# EAGLE design sx-rj45-verteiler-m-einspeisung (EAGLE 7.4.0)
Selectrix Arduino
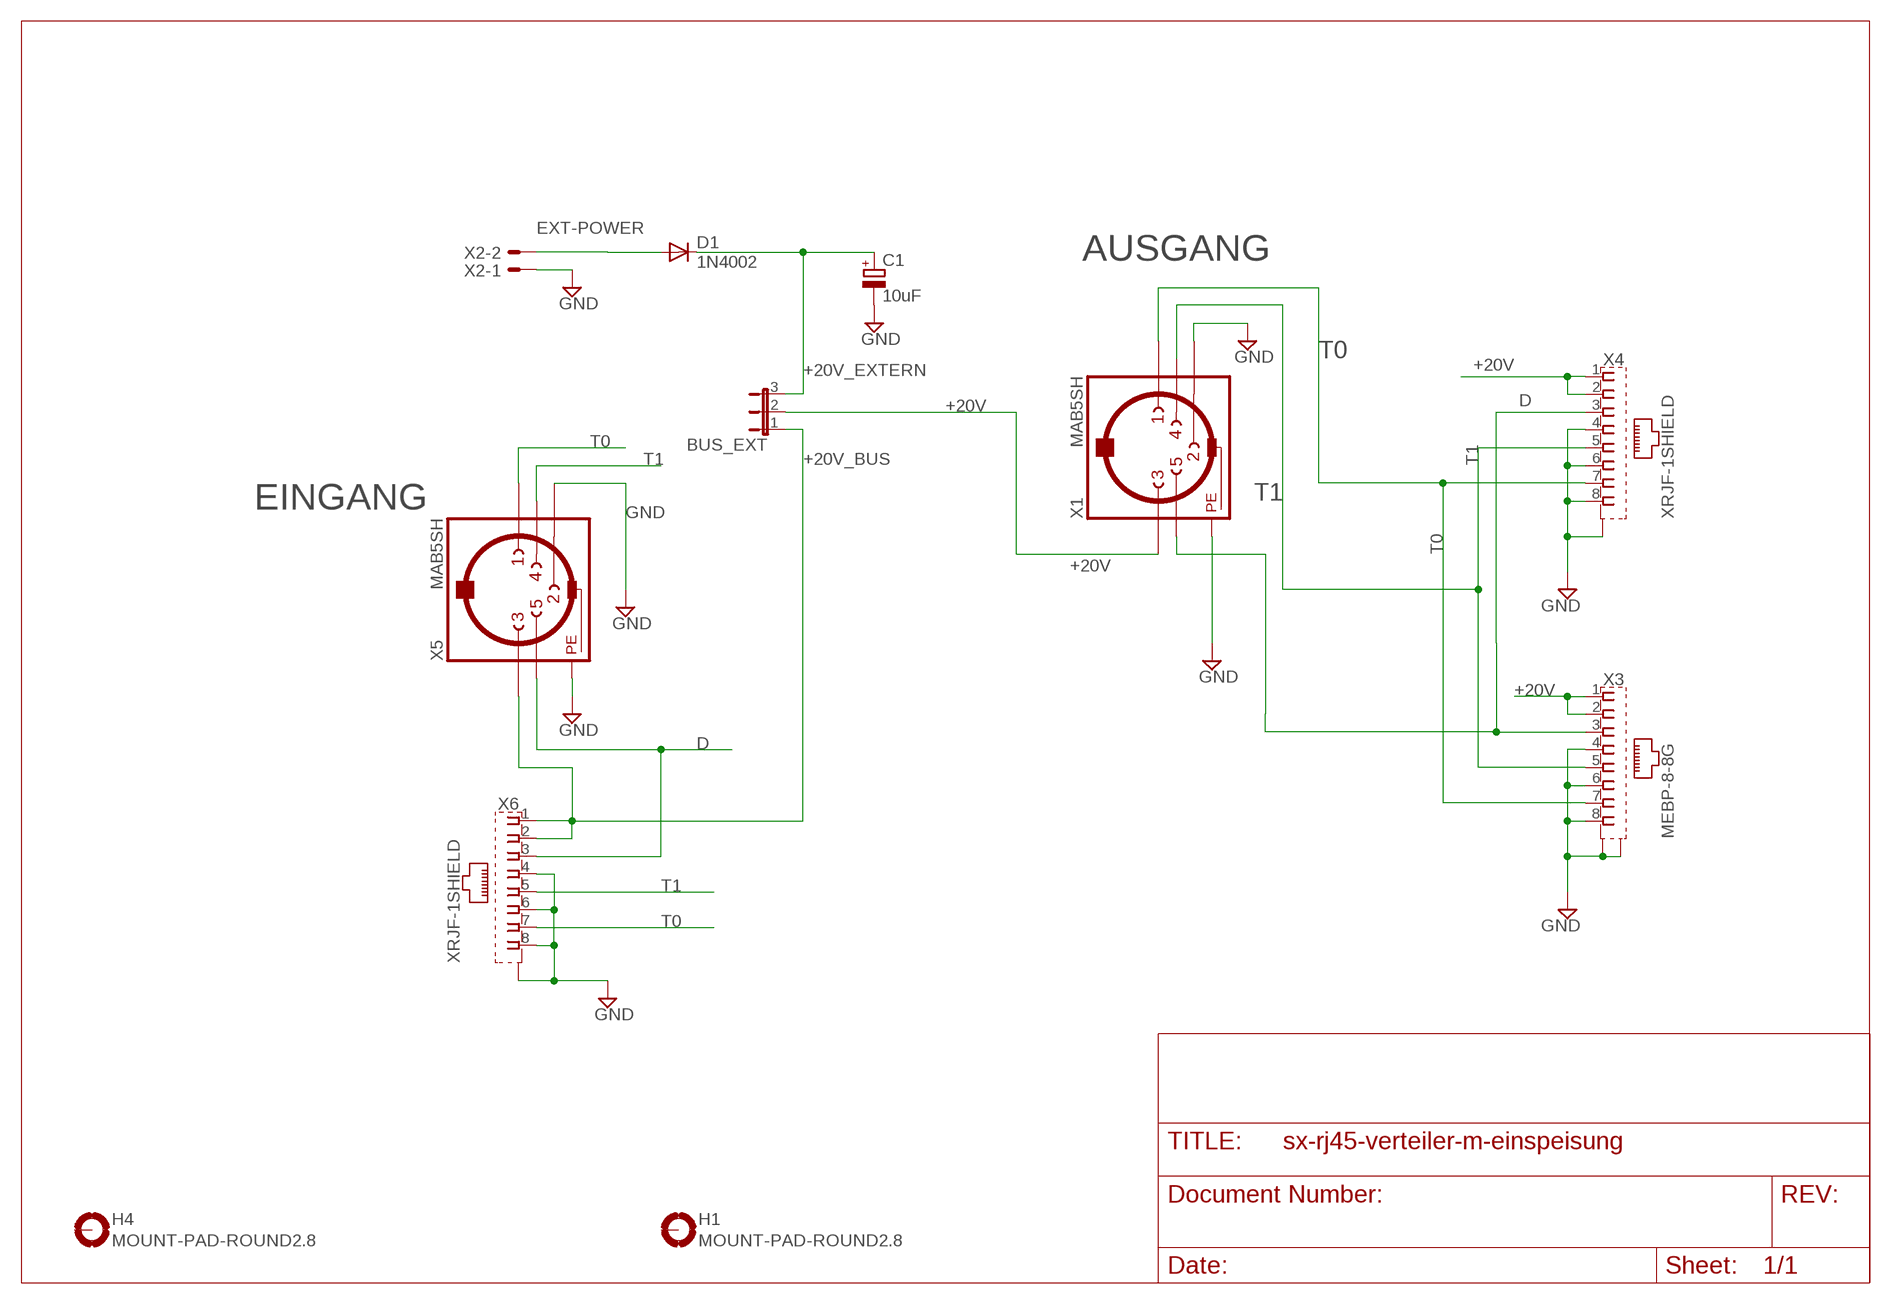
[diagram p0: schematic, sheet 1]

## Parts
BUS_EXT  JP2E  [JP2]
C1  10uF  CPOL-EUE2.5-7  [E2,5-7]
D1  1N4002  DIODE-DO201-15  [DO201-15]
H1  MOUNT-PAD-ROUND2.8  [2,8-PAD]
H4  MOUNT-PAD-ROUND2.8  [2,8-PAD]
X1  MAB5SH  [MAB5SH]
X2  AKL18X-02W  [AKL182-02]
X3  MEBP-8-8G  XRJF-01A-0-D2A-010MEBP-8-8G  [XRJF-01A-0-D2A-010]
X4  XRJF-1SHIELD  [XRJF-01A-OHNE_LOCH]
X5  MAB5SH  [MAB5SH]
X6  XRJF-1SHIELD  [XRJF-01A-OHNE_LOCH]

## Nets
+20V: BUS_EXT.2 X1.3 X3.1 X3.2 X4.1 X4.2
+20V_BUS [power]: BUS_EXT.1 X5.3 X6.1 X6.2
+20V_EXTERN: BUS_EXT.3 C1.+ D1.C
D: X1.5 X3.3 X4.3 X5.5 X6.3
EXT-POWER: D1.A X2.P$2
GND: C1.- X1.2 X1.PE X1.PE1(PE) X1.PE@1(PE) X1.PE@(PE) X2.P$1 X3.4 X3.6 X3.8 X3.S1(S) X3.S2(S) X4.4 X4.6 X4.8 X4.S1(S) X5.2 X5.PE X5.PE1(PE) X5.PE@1(PE) X5.PE@(PE) X6.4 X6.6 X6.8 X6.S1(S)
T0: X1.1 X3.7 X4.7 X5.1 X6.7
T1: X1.4 X3.5 X4.5 X5.4 X6.5
Unconnected: H1.B2,8(MOUNT) H4.B2,8(MOUNT)

## Notes on the sheet
- AUSGANG
- EINGANG

## Library data of the parts
BUS_EXT = jumper:JP2E: JUMPER
C1 = resistor:CPOL-EU: POLARIZED CAPACITOR, European symbol
D1 = diode:DIODE-: DIODE
H1 H4 = holes:MOUNT-PAD-ROUND: MOUNTING PAD, round
X1 X5 = con-hirschmann:MAB5SH: Female CONNECTOR 5 pins 90 deg. with shield, horizontal (DIN 41524); OC_FARNELL: 809883; OC_NEWARK: unknown
X2 = con-riacon_akl:AKL18X-02: Riacon AKL18X Steckverbinder 2-Pol Grid = 3,5mm
X3 = con-xmultiple-MB:XRJF: RJ45 Modular Buchse, without LED, schielded Source: Reichelt MEBP 8-8G http://cdn-reichelt.de/documents/datenblatt/G100/MEBP8-8G%23IMP.pdf
X4 X6 = con-xmultiple-MB2:XRJF-1SHIELD: RJ45 Modular Buchse, without LED, schielded Source: Reichelt MEBP 8-8G http://cdn-reichelt.de/documents/datenblatt/G100/MEBP8-8G%23IMP.pdf

## Net classes
1 power: width 0.61 mm

## Board
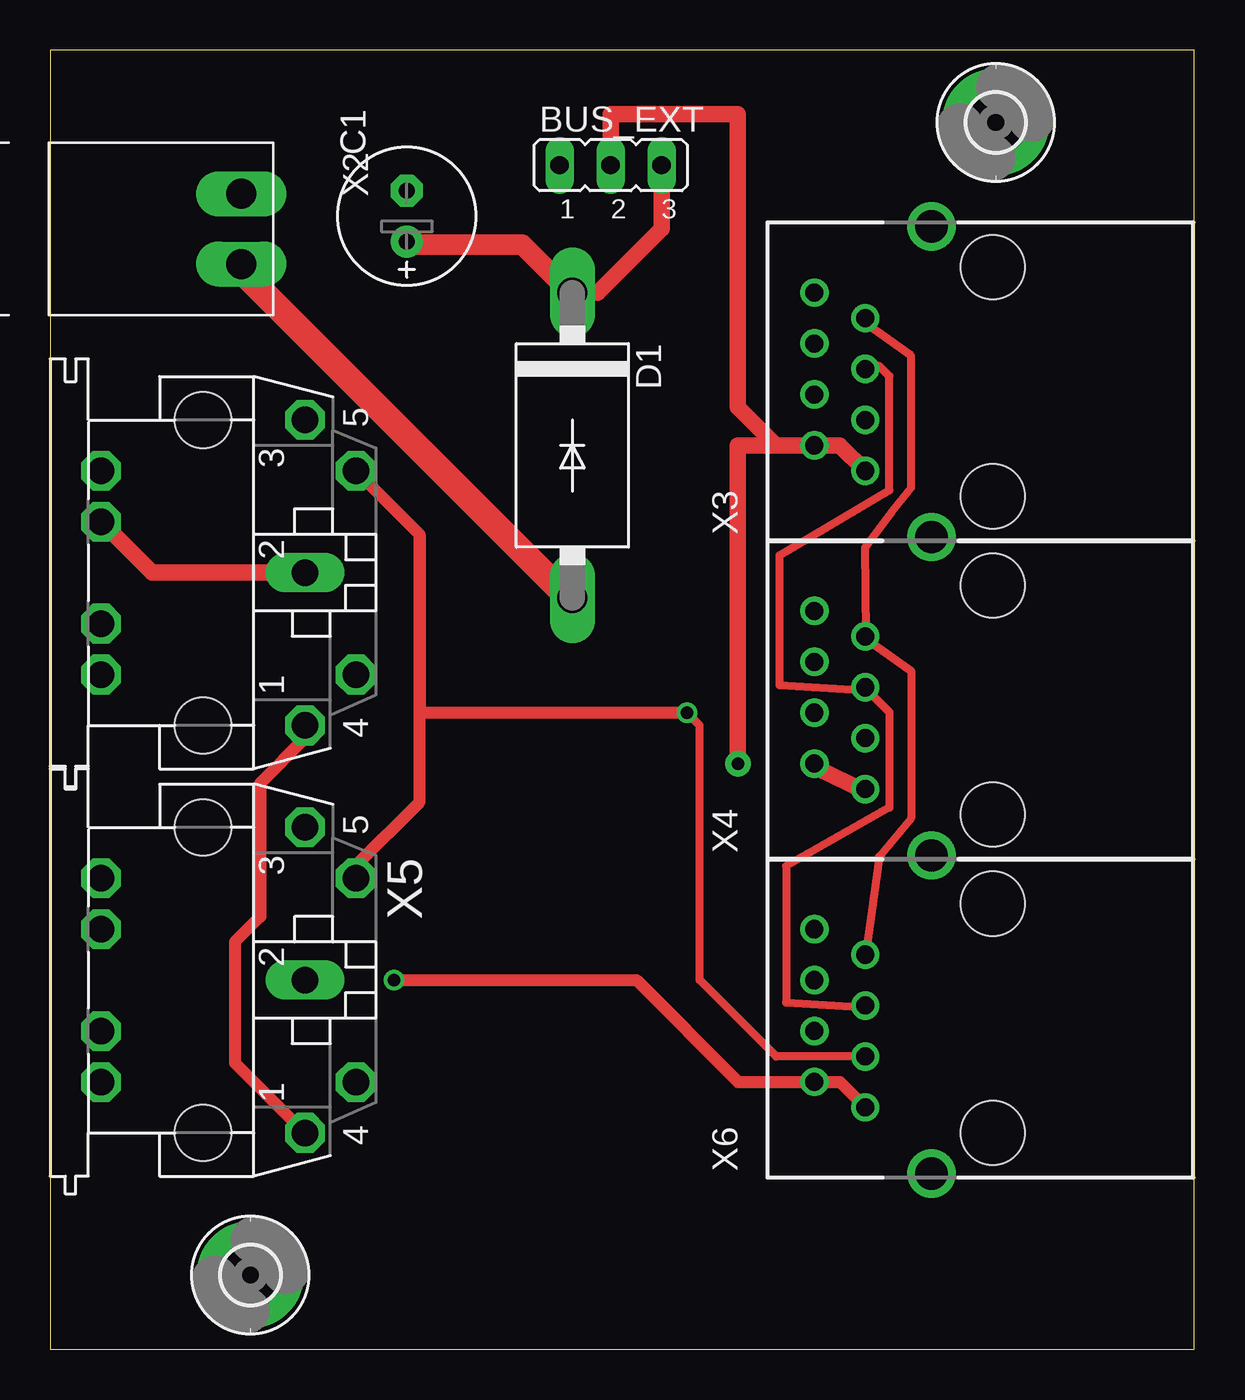
[diagram p1: board, top side]
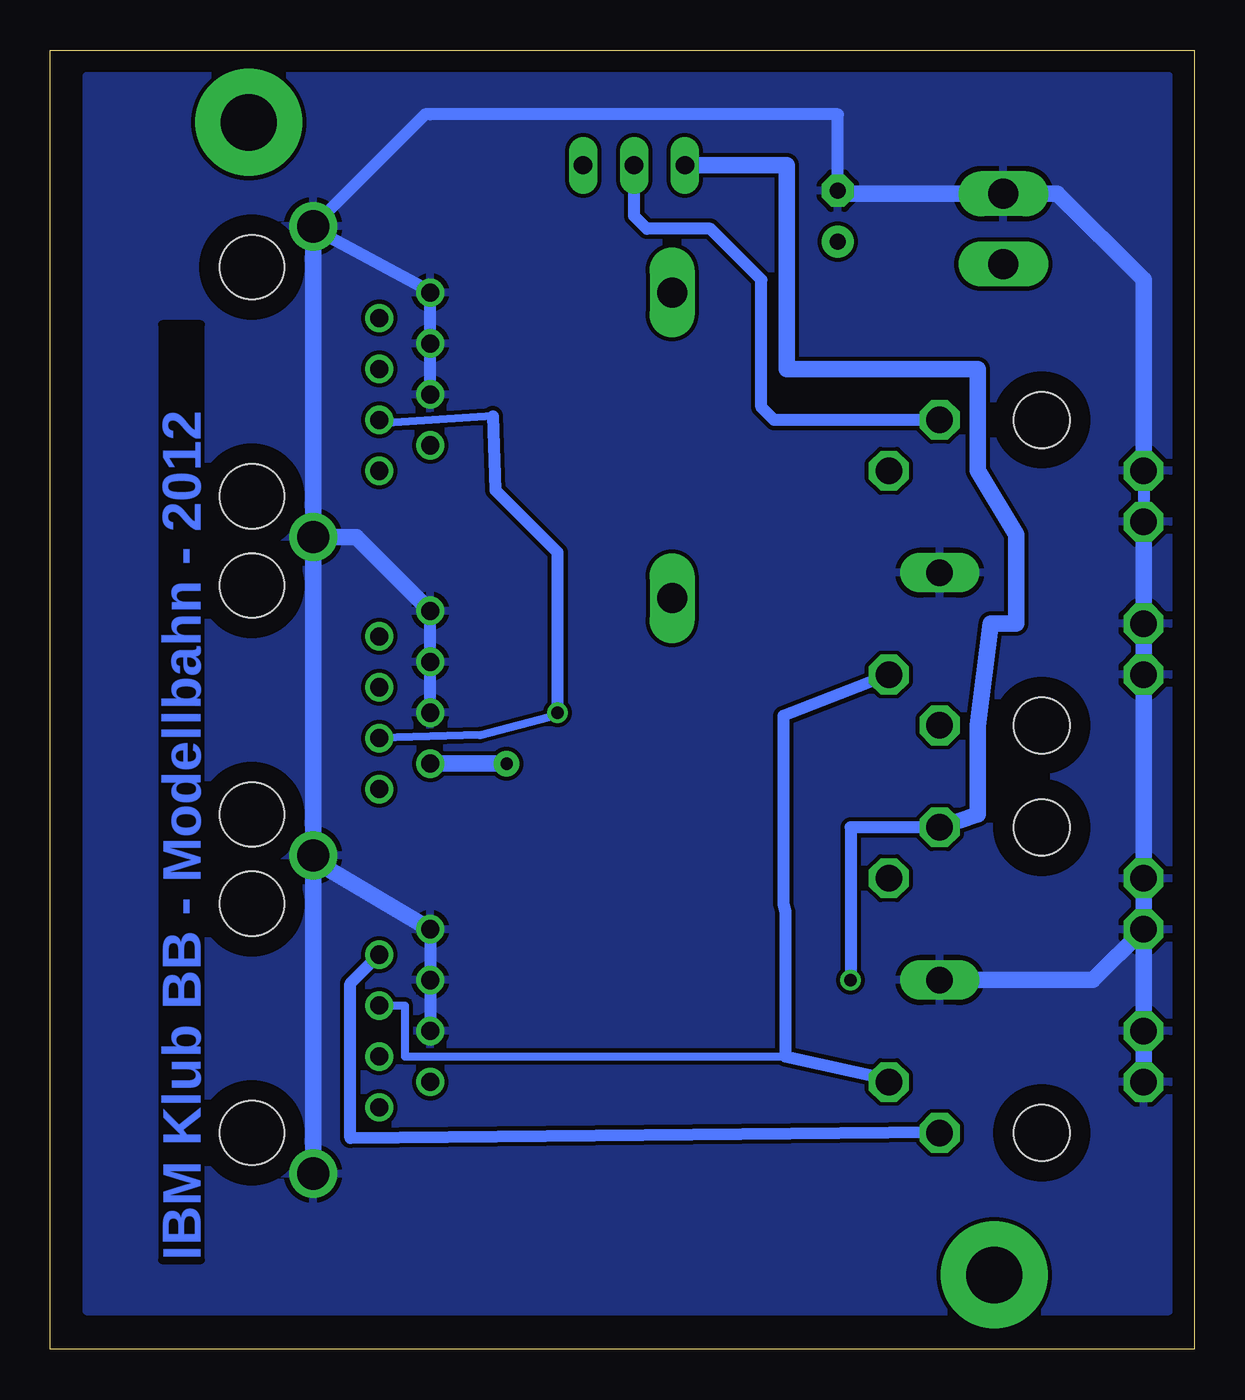
[diagram p2: board, bottom side, seen from below]

Size 57.05 x 64.8 mm. Coordinates in mm from the lower left corner, seen from the top.
Outline: 0,0 57.05,0 57.05,64.8 0,64.8 0,0
Copper layers (1*16): Top 0.035mm / dielectric 1.5mm / Bottom 0.035mm
Design rules "default": minimum track width 10mil, minimum drill 24mil, track to track 8mil, track to pad 8mil, pad to pad 8mil, via to via 8mil, smd to smd 8mil, copper to edge 40mil, drill to drill 8mil, minimum pad ring 10mil, minimum via ring 8mil, stop-mask expansion 4mil, vias tented up to drill 0mil, thermal gap 10mil

### Footprints (pad centres in the part's own frame; a part is rotated, then mirrored left to right if it is on the bottom)
JP2 = drill 0.914 long: 1 -2.54,0; 2 0,0; 3 2.54,0
E2,5-7 = drill 0.813 pad 1.6: + -1.27,0 | drill 0.813 pad 1.6 octagon: - 1.27,0
DO201-15 = drill 1.499 long: A 7.62,0; C -7.62,0
2,8-PAD = drill 2.8 pad 5.334: B2,8 0,0
MAB5SH = drill 1.321 octagon: 1 7.62,5.08; 3 -7.62,5.08; 4 5.08,7.62; 5 -5.08,7.62; PE -2.54,-5.08; PE1 -5.08,-5.08; PE@ 2.54,-5.08; PE@1 5.08,-5.08 | drill 1.321 long: 2 0,5.08 | hole 2.794: 7.62,0; -7.62,0
AKL182-02 = drill 1.5 pad 2.184 long: P$1 -1.75,0; P$2 1.75,0
XRJF-01A-0-D2A-010 = drill 0.9 pad 1.27: 1 -4.445,6.35; 2 -3.175,8.89; 3 -1.905,6.35; 4 -0.635,8.89; 5 0.635,6.35; 6 1.905,8.89; 7 3.175,6.35; 8 4.445,8.89 | drill 1.6 pad 2.184: S1 -7.745,3.05; S2 7.745,3.05 | hole 3.2: -5.715,0; 5.715,0
XRJF-01A-OHNE_LOCH = drill 0.9 pad 1.27: 1 -4.445,6.35; 2 -3.175,8.89; 3 -1.905,6.35; 4 -0.635,8.89; 5 0.635,6.35; 6 1.905,8.89; 7 3.175,6.35; 8 4.445,8.89 | drill 1.6 pad 2.184: S1 -7.745,3.05 | hole 3.2: -5.715,0; 5.715,0

### Placement (x,y rotation side)
BUS_EXT  27.94,59.05 0 top
C1  17.78,56.52 90 top
D1  26.04,45.09 270 top
H1  47.14,61.19 0 top
H4  9.98,3.71 0 top
X1  7.62,38.73 270 top
X2  9.53,55.88 270 top
X3  46.99,48.26 90 top
X4  46.99,32.38 90 top
X5  7.62,18.41 270 top
X6  46.99,16.51 90 top

### Tracks (layer width: path | path; a pad name or v marks a point on that pad's centre or on a via)
+20V  (via drill 0.61 pad 1.27)
  Top 0.61: 40.46,27.8 X4.1 | X3.2 39.37,45.09 X3.1
  Top 0.813: 40.46,27.8 40.68,27.8 38.18,29.03 X4.2 | X3.2 36.2,45.09 34.29,46.99 34.29,61.59 27.94,61.59 BUS_EXT.2 | X3.1 39.37,45.09 34.29,45.09 34.29,31.11 v34.29,29.21
  Bottom 0.61: X1.3 20.95,46.35 21.59,46.99 21.59,53.34 24.13,55.88 27.3,55.88 27.94,56.52 BUS_EXT.2
  Bottom 0.813: v34.29,29.21 X4.2
+20V_BUS  (via drill 0.61 pad 1.02)
  Top 0.61: v17.14,18.41 29.21,18.41 34.29,13.34 X6.2 39.37,13.34 X6.1
  Bottom 0.61: X5.3 17.14,26.04 v17.14,18.41
  Bottom 0.813: BUS_EXT.1 20.32,59.05 20.32,48.9 10.79,48.9 10.79,43.81 8.89,40.64 | 8.89,40.64 8.89,40.01 | 8.89,40.01 8.89,40.64 | 8.89,40.64 8.89,40.01 | 8.89,40.01 8.89,36.2 10.16,36.2 10.79,31.11 10.79,26.67 X5.3 | X5.3 13.34,26.04 X5.3
+20V_EXTERN
  Top 0.254: 17.96,55.09 C1.+ | 25.83,52.81 D1.C
  Top 0.813: D1.C 27.3,52.7 30.48,55.88 BUS_EXT.3
  Top 1.016: 17.96,55.09 23.55,55.09 25.83,52.81
D  (via drill 0.61 pad 1.02)
  Top 0.406: X6.3 36.2,14.61 32.38,18.41 32.38,31.11 v31.75,31.75
  Top 0.61: X5.5 15.24,24.13 18.41,27.3 18.41,31.75 | 18.41,31.75 18.41,40.64 | 18.41,40.64 X1.5 | 18.41,40.64 18.41,31.75 | 18.41,31.75 v31.75,31.75
  Bottom 0.254: 40.69,46.18 X3.3
  Bottom 0.406: 34.98,46.53 40.69,46.18 | 31.73,31.67 35.61,30.63 X4.3
  Bottom 0.61: 34.98,46.53 34.85,42.85 31.75,39.75 v31.75,31.75 31.75,31.7 31.73,31.67
EXT-POWER
  Top 0.254: 25.83,37.49 D1.A | X2.P$2 9.6,54.18 9.37,53.95
  Top 1.27: 8.38,54.18 9.14,54.18 9.37,53.95 25.83,37.49
GND
  Top 0.813: X1.2 5.08,38.73 X1.PE
  Bottom 0.254: 44.09,55.98 43.89,55.78 X3.S2 | 38.18,52.81 X3.8
  Bottom 0.61: 17.78,57.63 17.78,61.59 38.1,61.59 38.35,61.59 X3.S2 | X1.PE1 X1.PE | X3.4 X3.6 X3.8 | 38.18,52.81 44.09,55.98 | X6.8 X6.6 X6.4 | X4.4 X4.6 X4.8
  Bottom 0.813: C1.- 17.78,57.63 X2.P$1 6.83,57.63 2.54,53.34 X1.PE1 | X1.PE X1.PE@ X1.PE@1 X5.PE1 X5.PE | X5.2 5.08,18.41 X5.PE | X5.PE@1 X5.PE@ X5.PE | X4.S1 X3.S1 | X3.S1 X3.S2 | X4.S1 44.33,24.64 X6.8 | X6.S1 X4.S1 | X3.S1 41.78,40.52 X4.8
  pour Bottom: 1.27,63.5 55.24,63.5 55.24,62.23 55.24,1.91 1.27,1.91 1.27,2.54
T0
  Top 0.254: 40.69,51.16 40.69,51.44 X3.7 | 40.69,35.66 X4.7
  Top 0.406: X6.7 40.69,19.89 41.33,24.56 42.93,26.48 42.93,33.83 40.69,35.43 X4.7 | 40.69,51.16 42.93,49.55 42.93,42.98 41.91,41.71 40.64,40.01 40.69,35.66
  Top 0.61: X1.1 12.7,30.48 10.48,28.26 10.48,21.59 9.21,20.32 9.21,14.29 X5.1
  Bottom 0.254: 12.8,10.86 X5.1 | 40.69,19.66 X6.7
  Bottom 0.61: 12.8,10.86 42.08,10.54 42.08,18.25 X6.7
T1
  Top 0.254: 40.46,17.14 X6.5
  Top 0.406: 40.46,17.14 41.1,17.02 36.69,17.3 36.69,24.11 41.83,27.03 41.83,31.77 40.78,32.83 | 40.78,32.83 40.69,32.92 X4.5 | 40.78,32.83 36.37,33.11 36.37,39.61 41.83,42.85 41.83,48.54 41.33,49.05 40.69,48.69 X3.5
  Top 0.61: 40.78,32.83 X4.5
  Bottom 0.254: 15.32,13.49 X5.4 | 15.32,33.6 X1.4 | 40.46,17.14 X6.5
  Bottom 0.406: 40.46,17.14 39.37,17.14 39.37,14.61 20.4,14.61
  Bottom 0.61: 15.32,13.49 20.4,14.61 20.4,21.81 20.5,22.23 20.5,31.6 15.32,33.6

### Text on the board
Bottom: IBM Klub BB - Modellbahn - 2012